# Altium schematic sheet GregTrack_BIG_LTE_v1_0.SchDoc: PCA10090 - nRF9160
size A3; Organization: Nordic Semiconductor; DocumentNumber: 2; SheetNumber: 2; SheetTotal: 8; CompanyName: Nordic Semiconductor; DocumentSize: A3
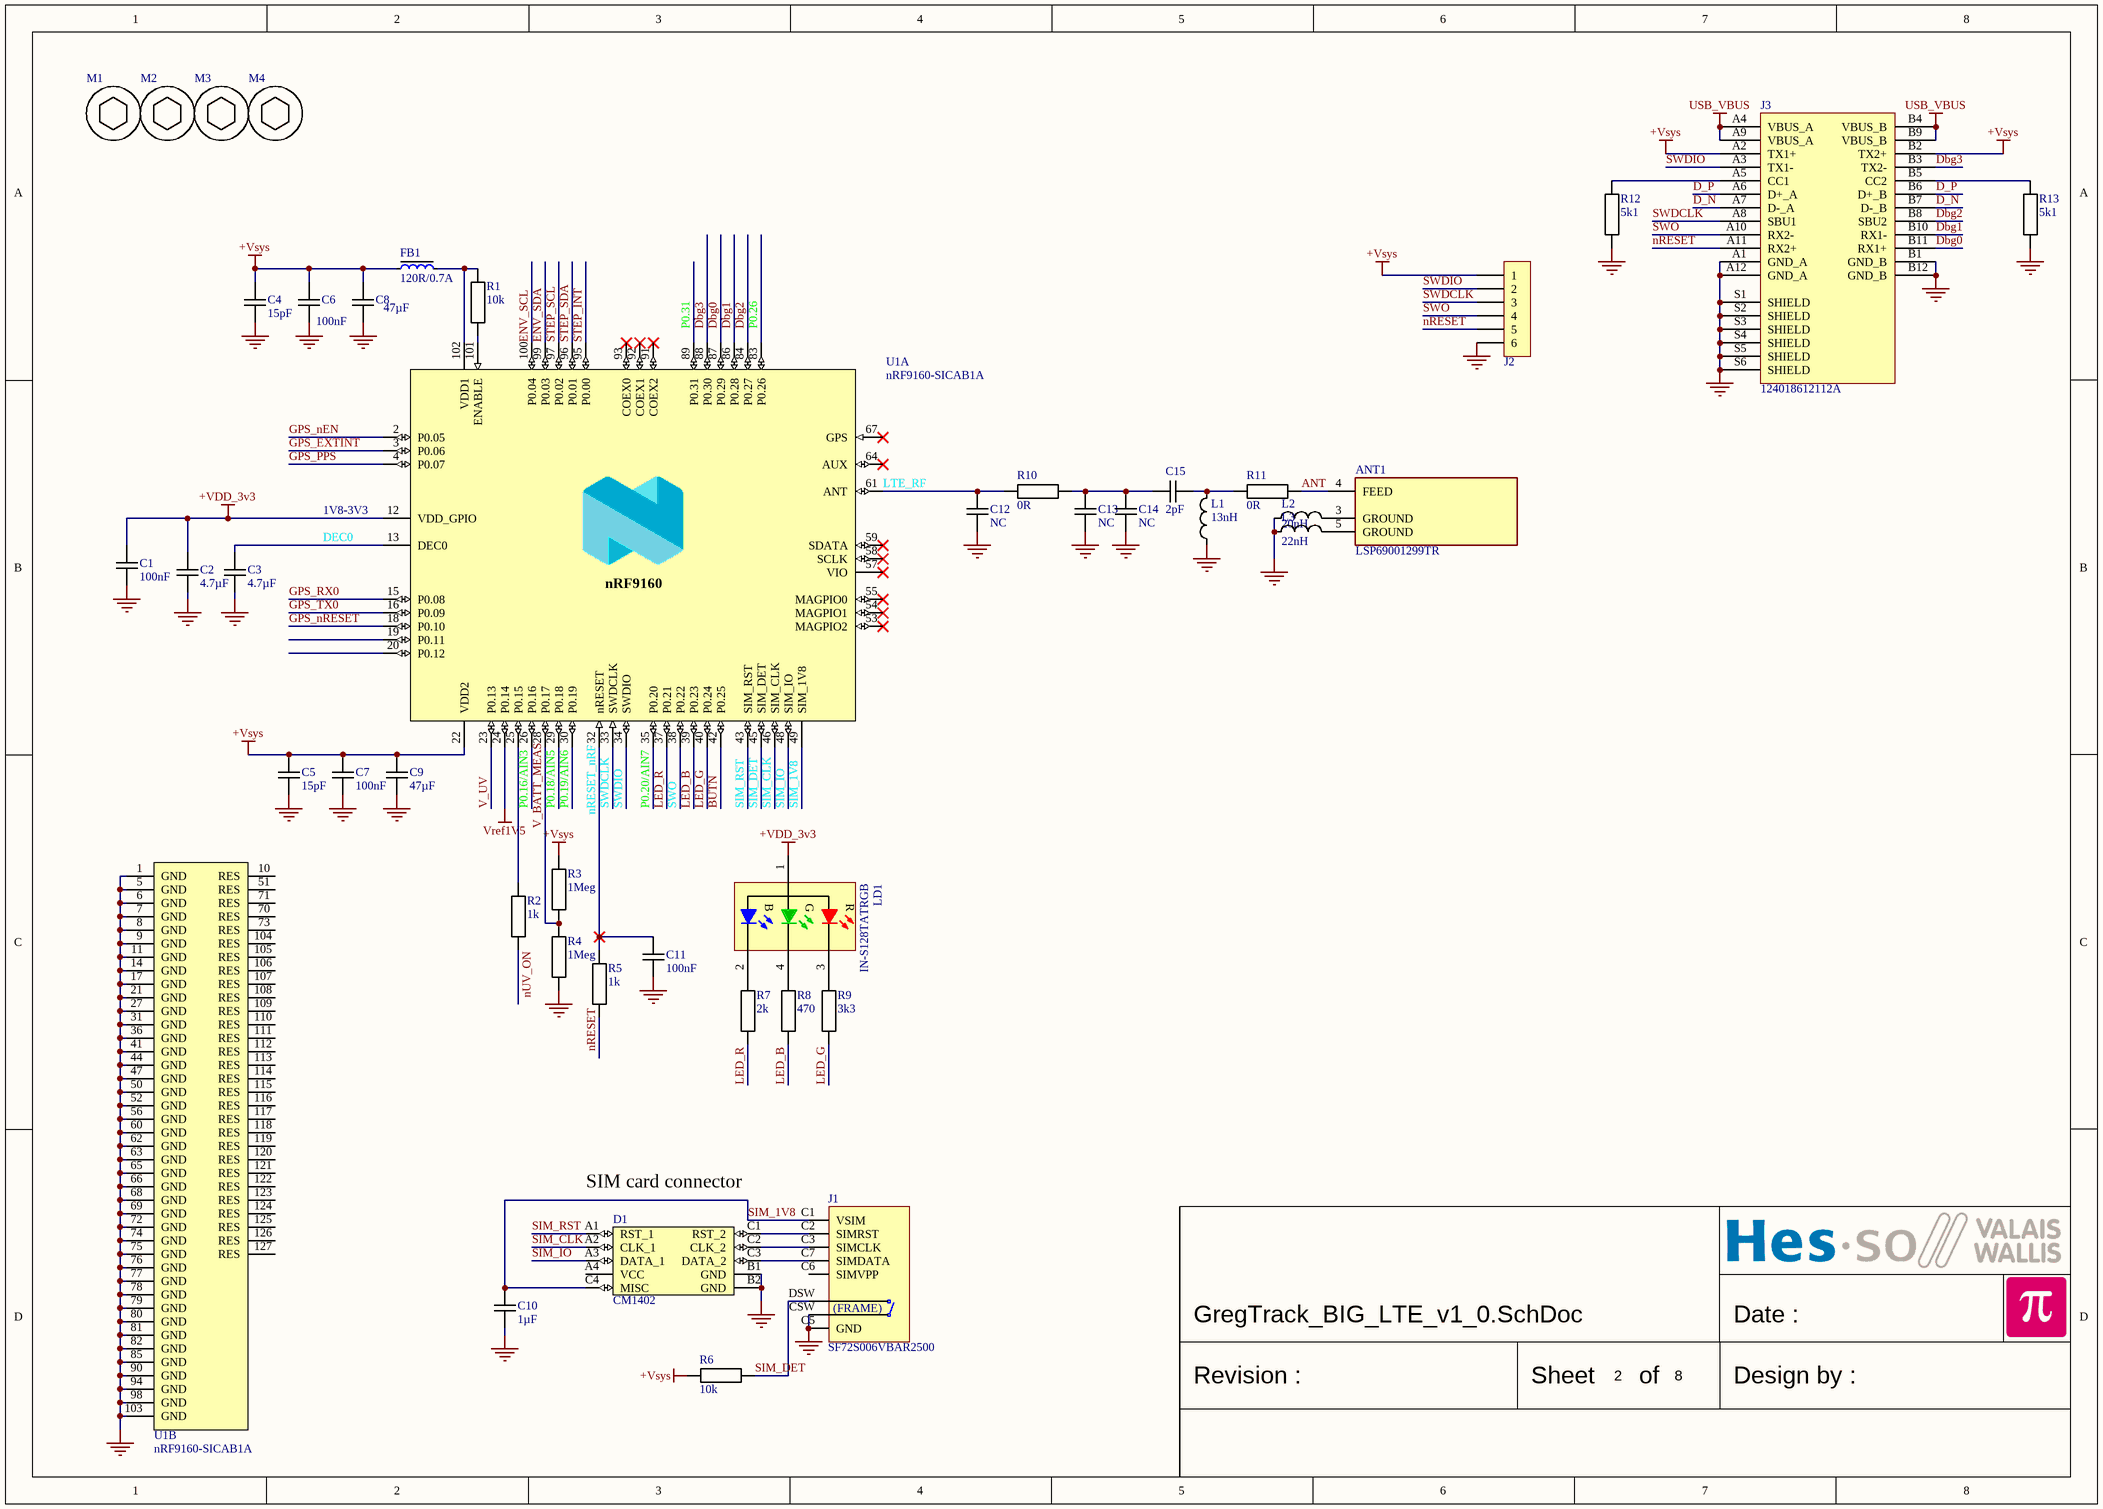
[diagram p0: GregTrack_BIG_LTE_v1_0.SchDoc]

## Parts
ANT1  LSP69001299TR  [Antenna LSP69001299TR]
C1  100nF  [CAPACITOR 1005 REFLOW]
C2  4.7µF  [CAPACITOR 1608 REFLOW]
C3  4.7µF  [CAPACITOR 1608 REFLOW]
C4  15pF  [CAPACITOR 1005 REFLOW]
C5  15pF  [CAPACITOR 1005 REFLOW]
C6  100nF  [CAPACITOR 1005 REFLOW]
C7  100nF  [CAPACITOR 1005 REFLOW]
C8  47µF  [CAPACITOR 2012 REFLOW]
C9  47µF  [CAPACITOR 2012 REFLOW]
C10  1µF  [CAPACITOR 1005 REFLOW]
C11  100nF  [CAPACITOR 1005 REFLOW]
C12  NC  [CAPACITOR 1005 REFLOW]
C13  NC  [CAPACITOR 1005 REFLOW]
C14  NC  [CAPACITOR 1005 REFLOW]
C15  2pF  [CAPACITOR 1005 REFLOW]
D1  CM1402  [CM1402]
FB1  120R/0.7A  [INDC1005X04L]
J1  SF72S006VBAR2500  [SF72S006VBAR2500]
J2  NC  [PinHeader1x6 P1.27]  (value not drawn)
J3  124018612112A  [USB-C SMD AMPHENOL 124018612112A]
L1  13nH  [INDUCTOR 1005 REFLOW]
L2  20nH  [INDUCTOR 1005 REFLOW]
L3  22nH  [INDUCTOR 1005 REFLOW]
LD1  IN-S128TATRGB  [LED IN-S128TATRGB]
M1  (no value)  [Screw Hex Socket M2.5X4 Unconnected]
M2  (no value)  [Screw Hex Socket M2.5X4 Unconnected]
M3  (no value)  [Screw Hex Socket M2.5X4 Unconnected]
M4  (no value)  [Screw Hex Socket M2.5X4 Unconnected]
R1  10k  [RESISTOR 1005 REFLOW]
R2  1k  [RESISTOR 1005 REFLOW]
R3  1Meg  [RESISTOR 1005 REFLOW]
R4  1Meg  [RESISTOR 1005 REFLOW]
R5  1k  [RESISTOR 1005 REFLOW]
R6  10k  [RESISTOR 1005 REFLOW]
R7  2k  [RESISTOR 1005 REFLOW]
R8  470  [RESISTOR 1005 REFLOW]
R9  3k3  [RESISTOR 1005 REFLOW]
R10  0R  [RESISTOR 1005 REFLOW]
R11  0R  [RESISTOR 1005 REFLOW]
R12  5k1  [RESISTOR 1005 REFLOW]
R13  5k1  [RESISTOR 1005 REFLOW]
U1  nRF9160-SICAB1A  [LGA50P1600X1050X104-161N]  (parts A,B of 2)

## Nets
+VDD_3v3: C1.1 C2.1 LD1.1(A) U1.12(VDD_GPIO)
+Vsys: C4.1 C5.1 C6.1 C7.1 C8.1 C9.1 FB1.1 J2.1 J3.A2(TX1+) J3.B2(TX2+) R3.1 R6.1 U1.22(VDD2)
GND: C1.2 C2.2 C3.2 C4.2 C5.2 C6.2 C7.2 C8.2 C9.2 C10.2 C11.2 C12.1 C13.1 C14.1 D1.B1(GND) D1.B2(GND) J1.0(GND) J1.C5(GND) J1.CSW J2.6 J3.A1(GND_A) J3.A12(GND_A) J3.B1(GND_B) J3.B12(GND_B) J3.S1(SHIELD) J3.S2(SHIELD) J3.S3(SHIELD) J3.S4(SHIELD) J3.S5(SHIELD) J3.S6(SHIELD) L1.1 L2.1 L3.1 R4.2 R12.1 R13.1 U1.1(GND) U1.5(GND) U1.6(GND) U1.7(GND) U1.8(GND) U1.9(GND) U1.11(GND) U1.14(GND) U1.17(GND) U1.21(GND) U1.27(GND) U1.31(GND) U1.36(GND) U1.41(GND) U1.44(GND) U1.47(GND) U1.50(GND) U1.52(GND) U1.56(GND) U1.60(GND) U1.62(GND) U1.63(GND) U1.65(GND) U1.66(GND) U1.68(GND) U1.69(GND) U1.72(GND) U1.74(GND) U1.75(GND) U1.76(GND) U1.77(GND) U1.78(GND) U1.79(GND) U1.80(GND) U1.81(GND) U1.82(GND) U1.85(GND) U1.90(GND) U1.94(GND) U1.98(GND) U1.103(GND)
USB_VBUS: J3.A4(VBUS_A) J3.A9(VBUS_A) J3.B4(VBUS_B) J3.B9(VBUS_B)
Vref1V5: U1.24(P0.14)
ANT: ANT1.4(FEED) R11.2
BUTN: U1.42(P0.25)
D_N: J3.A7(D-_A) J3.B7(D-_B)
D_P: J3.A6(D+_A) J3.B6(D+_B)
Dbg0: J3.B11(RX1+) U1.87(P0.29)
Dbg1: J3.B10(RX1-) U1.86(P0.28)
Dbg2: J3.B8(SBU2) U1.84(P0.27)
Dbg3: J3.B3(TX2-) U1.88(P0.30)
DEC0: C3.1 U1.13(DEC0)
ENV_SCL: U1.100(P0.04)
ENV_SDA: U1.99(P0.03)
GPS_EXTINT: U1.3(P0.06)
GPS_nEN: U1.2(P0.05)
GPS_nRESET: U1.18(P0.10)
GPS_PPS: U1.4(P0.07)
GPS_RX0: U1.15(P0.08)
GPS_TX0: U1.16(P0.09)
LED_B: R8.2 U1.39(P0.23)
LED_G: R9.2 U1.40(P0.24)
LED_R: R7.2 U1.37(P0.21)
LTE_RF: C12.2 R10.1 U1.61(ANT)
nRESET: J2.5 J3.A11(RX2+) R5.2
nRESET_nRF: C11.1 R5.1 U1.32(nRESET)
nUV_ON: R2.2
P0.16/AIN3: U1.26(P0.16)
P0.18/AIN5: U1.29(P0.18)
P0.19/AIN6: U1.30(P0.19)
P0.20/AIN7: U1.35(P0.20)
P0.26: U1.83(P0.26)
P0.31: U1.89(P0.31)
SIM_1V8: C10.1 D1.C4(MISC) J1.C1(VSIM) U1.49(SIM_1V8)
SIM_CLK: D1.A2(CLK_1) U1.46(SIM_CLK)
SIM_DET: J1.DSW R6.2 U1.45(SIM_DET)
SIM_IO: D1.A3(DATA_1) U1.48(SIM_IO)
SIM_RST: D1.A1(RST_1) U1.43(SIM_RST)
STEP_INT: U1.95(P0.00)
STEP_SCL: U1.97(P0.02)
STEP_SDA: U1.96(P0.01)
SWDCLK: J2.3 J3.A8(SBU1) U1.33(SWDCLK)
SWDIO: J2.2 J3.A3(TX1-) U1.34(SWDIO)
SWO: J2.4 J3.A10(RX2-) U1.38(P0.22)
V_BATT_MEAS: R3.2 R4.1 U1.28(P0.17)
V_UV: U1.23(P0.13)
NetANT1_3: ANT1.3(GROUND) L2.2
NetANT1_5: ANT1.5(GROUND) L3.2
NetC13_2: C13.2 C14.2 C15.1 R10.2
NetC15_2: C15.2 L1.2 R11.1
NetD1_C1: D1.C1(RST_2) J1.C2(SIMRST)
NetD1_C2: D1.C2(CLK_2) J1.C3(SIMCLK)
NetD1_C3: D1.C3(DATA_2) J1.C7(SIMDATA)
NetFB1_2: FB1.2 R1.1 U1.102(VDD1)
NetJ3_A5: J3.A5(CC1) R12.2
NetJ3_B5: J3.B5(CC2) R13.2
NetLD1_2: LD1.2(B) R7.1
NetLD1_3: LD1.3(R) R9.1
NetLD1_4: LD1.4(G) R8.1
NetR1_2: R1.2 U1.101(ENABLE)
NetR2_1: R2.1 U1.25(P0.15)

Not connected (* = marked no-connect by the designer): D1 A4(VCC); J1 C6(SIMVPP); U1 10(RES) 19(P0.11) 20(P0.12) 51(RES) 53(MAGPIO2)* 54(MAGPIO1)* 55(MAGPIO0)* 57(VIO)* 58(SCLK)* 59(SDATA)* 64(AUX)* 67(GPS)* 70(RES) 71(RES) 73(RES) 91(COEX2)* 92(COEX1)* 93(COEX0)* 104(RES) 105(RES) 106(RES) 107(RES) 108(RES) 109(RES) 110(RES) 111(RES) 112(RES) 113(RES) 114(RES) 115(RES) 116(RES) 117(RES) 118(RES) 119(RES) 120(RES) 121(RES) 122(RES) 123(RES) 124(RES) 125(RES) 126(RES) 127(RES)

## Notes on the sheet
- (near U1) 1V8-3V3
- (near D1) SIM card connector
- Date :
- Revision :
- Sheet
- of
- Design by :
- (in symbol nRF9160-SICAB1A, part A) nRF9160
- (in symbol SF72S006VBAR2500) (FRAME)

## Library data of the parts
ANT1 = Antenna AVX LSP69001299TR: LTE Cat-M1 / NB-IoT Antenna; ECassembly: YES; Value: LSP69001299TR
C1 C6 C7 C11 = Capacitor: Capacitor 1005; Value: 100nF, 10V; TempCoef: X5R; Tolerance: 20%; Voltage: 10V; ECassembly: YES
C2 C3 = Capacitor: Capacitor 1608; Value: 4.7µF, 10V; TempCoef: X5R; Tolerance: 20%; Voltage: 10V; ECassembly: YES
C4 C5 = Capacitor: Capacitor 1005; Value: 15pF, 10V; TempCoef: CG0/NP0; Voltage: 10V; Tolerance: 10%; ECassembly: YES
C8 C9 = Capacitor: Capacitor 2012; Value: 47µF, 10V; TempCoef: X5R; Tolerance: 20%; Voltage: 10V; ECassembly: YES
C10 = Capacitor: Capacitor 1005; Value: 1µF, 10V; TempCoef: X5R; Tolerance: 20%; Voltage: 10V; ECassembly: YES
C12-C15 = Capacitor: Capacitor 1005; TempCoef: CG0/NP0; Voltage: 10V; Tolerance: 5%; ECassembly: YES
  C12-C14: Value: NC
  C15: Value: 2pF
D1 = CM1402: EMI Network Filter Arrays SIM CARD EMI FILTER WITH ESD PROTECTION; ECassembly: YES; Value: CM1402
FB1 = FB0402-120R@100M-700mA: Ferrite Bead, 120 Ohm @ 100MHz, 700mA, 130 mOhm Max; ECassembly: YES; Value: 120R/0.7A
J1 = SF72S006VBAR2500: n 8 (6 + 2) Position Card Connector NANO SIM Surface Mount, Right Angle Gold; ECassembly: YES; Value: SF72S006VBAR2500
J2 = PinHeader1x6: Plug connector; ECassembly: NO; Value: NC
J3 = USB-C SMD AMPHENOL 124018612112A: USB-C, USB 3.2 Gen 2 (USB 3.1 Gen 2, Superspeed + (USB 3.1)) Receptacle Connector 24 Position Surface Mount, Right Angle; Through Hole; ECassembly: YES; Value: 124018612112A
L1-L3 = Inductor: ECassembly: YES
  L1: Value: 13nH
  L2: Value: 20nH
  L3: Value: 22nH
LD1 = LED Inolux IN-S128TATRGB: Top View SMD LED 1210 PCB Type; Value: IN-S128TATRGB
M1-M4 = Screw Hex Socket Unconnected: Screw Hex Socket Unconnected BN610
R1 R2 R5-R11 = Resistor: Resistor 1005; Tolerance: 1%; ECassembly: YES
  R1 R6: Value: 10k
  R2 R5: Value: 1k
  R7: Value: 2k
  R8: Value: 470
  R9: Value: 3k3
  R10 R11: Value: 0R
R3 R4 = Resistor: Resistor 1005; Value: 1M; Tolerance: 1%; ECassembly: YES
R12 R13 = Resistor: Resistor 1005; Value: 5.1k; Tolerance: 1%; ECassembly: YES
U1 = nRF9160-SICAB1A: Low power System-in-Package with integrated LTE-M/NB-IoT modem and GPS; ECassembly: YES; Value: nRF9160-SICAB1A